# Altium schematic sheet PA_Transmitter_3LD.SchDoc
size A3; PageSetup: Record=PageOptions|CenterHorizontal=True|CenterVertical=True|PrintScale=0.73|XCorrection=1.00|YCorrection=1.00|PrintKind=0|BorderSize=5000000|LeftOffset=0|BottomOffset=0|Orientation=2|PaperLength=1000|PaperWidth=1000|Scale=100|PaperSource=7|PrintQuality=-3|MediaType=1|DitherType=10|PrintScaleMode=1|PaperKind=A4|PaperIndex=9
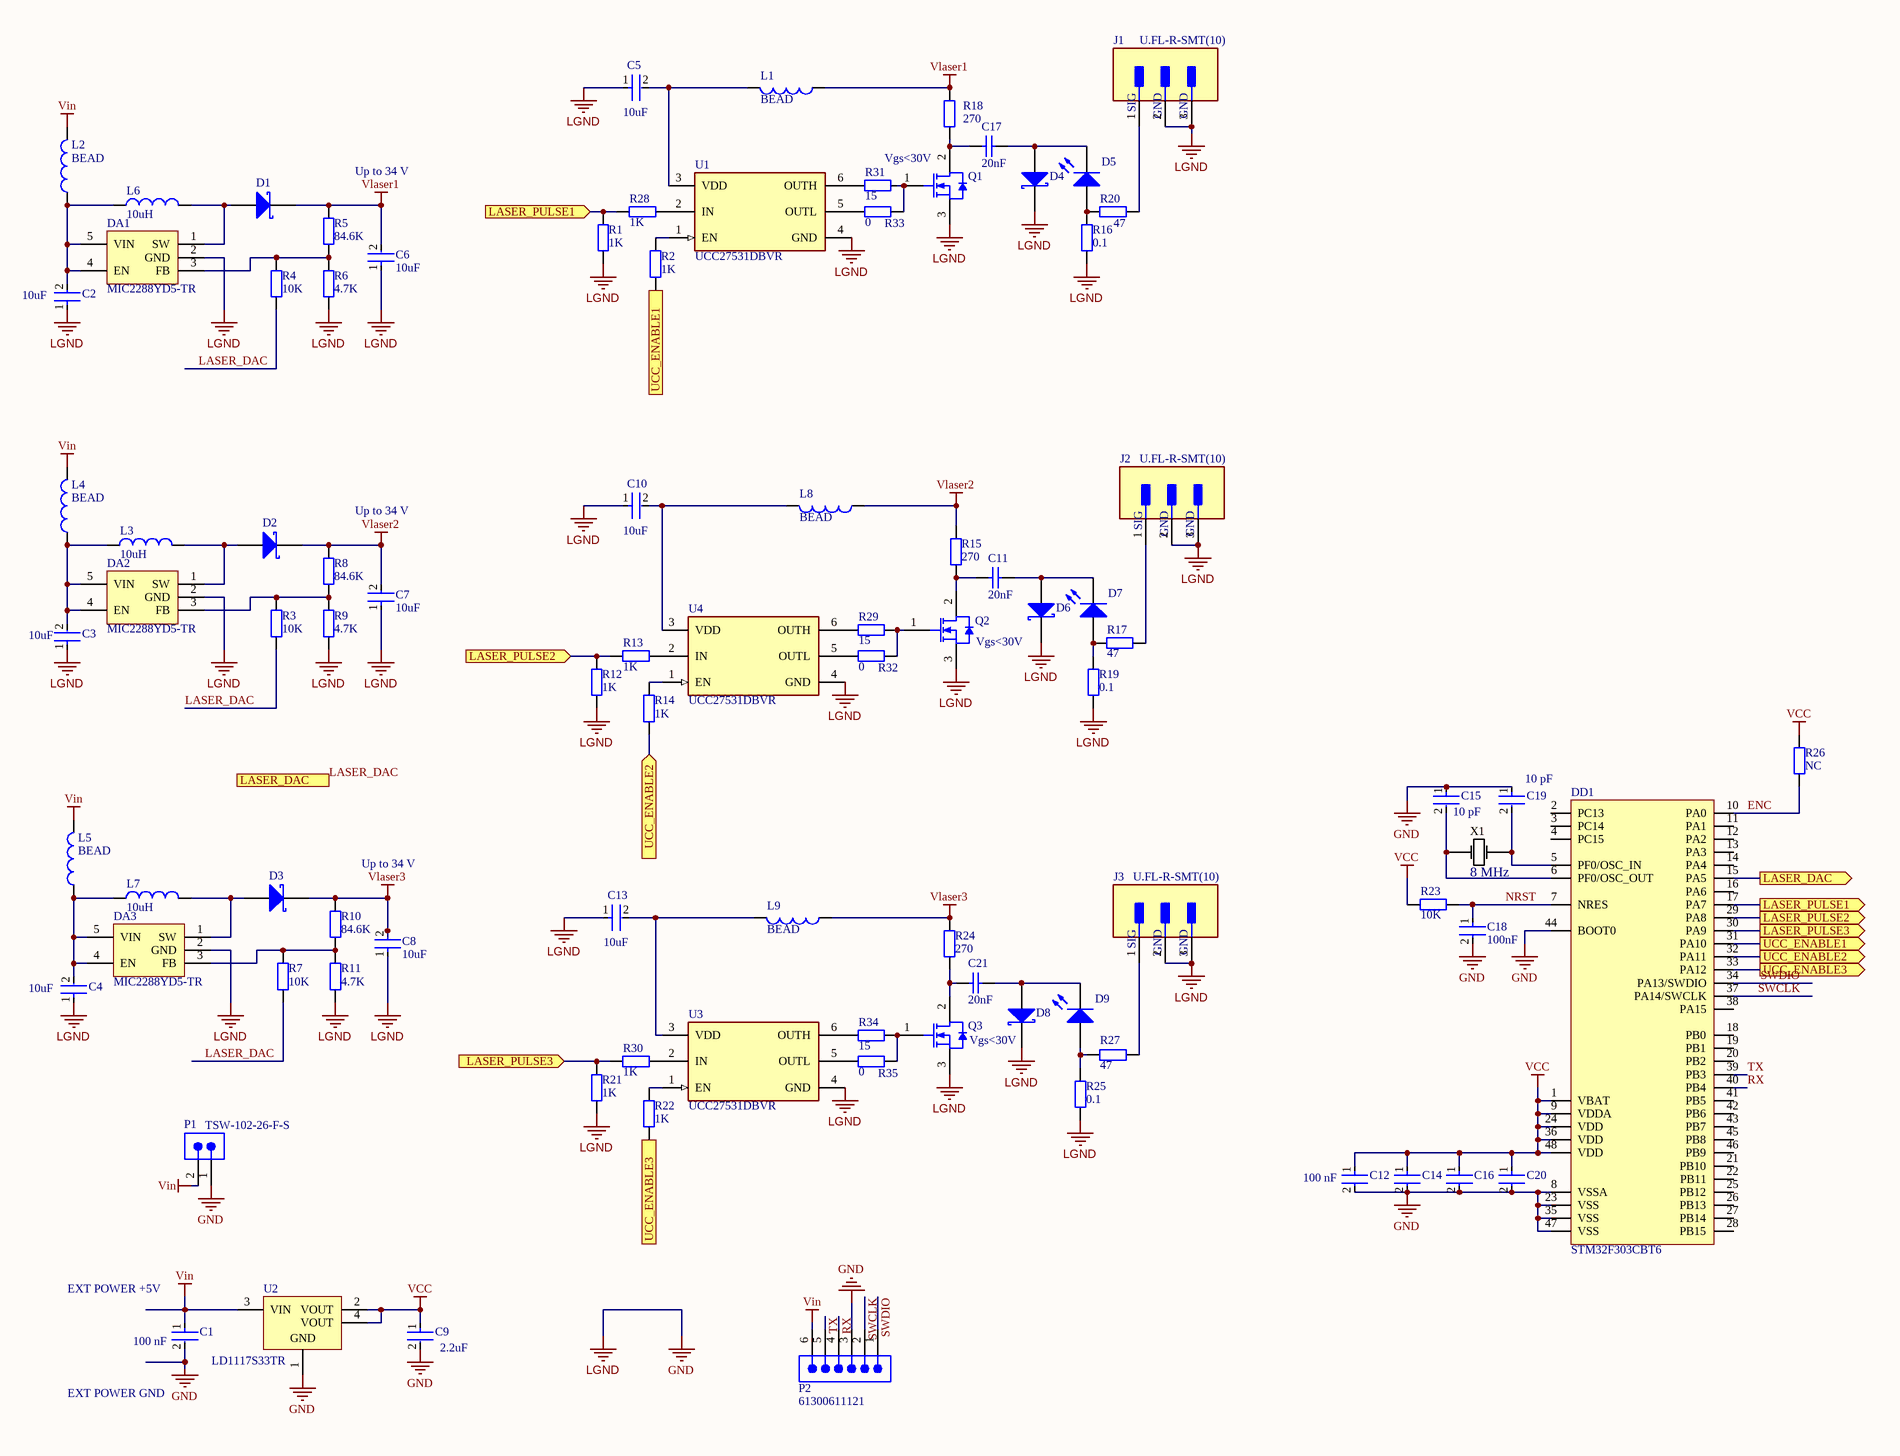
[diagram p0: PA_Transmitter_3LD.SchDoc, right]

## Parts
C1  value 100 nF  [FP-CC0603-DA-MFG]
C2  10uF  [FP-CL31B106KBHNNNE-MFG]
C3  10uF  [FP-CL31B106KBHNNNE-MFG]
C4  10uF  [FP-CL31B106KBHNNNE-MFG]
C5  10uF  [FP-CL31B106KBHNNNE-MFG]
C6  10uF  [FP-CL31B106KBHNNNE-MFG]
C7  10uF  [FP-CL31B106KBHNNNE-MFG]
C8  10uF  [FP-CL31B106KBHNNNE-MFG]
C9  Capacitance: 2.2uF  [FP-CL10-IPC_A]
C10  10uF  [FP-CL31B106KBHNNNE-MFG]
C11  20nF  [RESC2013X60X35NL10T20]
C12  Capacitance: 100 nF  [FP-CC0805-0_85-MFG]  (hidden comment: CC0805KRX7R9BB104)
C13  10uF  [FP-CL31B106KBHNNNE-MFG]
C14  CC0805KRX7R9BB104  [FP-CC0805-0_85-MFG]  (value not drawn)
C15  value 10 pF  [FP-C0805C-DN-MFG]  (hidden comment: C0805C100J5RACTU)
C16  CC0805KRX7R9BB104  [FP-CC0805-0_85-MFG]  (value not drawn)
C17  20nF  [RESC2013X60X35ML10T20]
C18  100nF  [FP-CC0805-0_85-MFG]
C19  value 10 pF  [FP-C0805C-DN-MFG]
C20  CC0805KRX7R9BB104  [FP-CC0805-0_85-MFG]  (value not drawn)
C21  20nF  [RESC2013X60X35NL10T20]
D1  Schottky Diode  [FP-PG-SC79-2-MFG]  (value not drawn)
D2  Schottky Diode  [FP-PG-SC79-2-MFG]  (value not drawn)
D3  Schottky Diode  [FP-PG-SC79-2-MFG]  (value not drawn)
D4  Schottky Diode  [FP-PG-SC79-2-MFG]  (value not drawn)
D5  Light-Emitting Diode  [FP-DPGEW1S09H-MFG]  (value not drawn)
D6  Schottky Diode  [FP-PG-SC79-2-MFG]  (value not drawn)
D7  Light-Emitting Diode  [FP-DPGEW1S09H-MFG]  (value not drawn)
D8  Schottky Diode  [FP-PG-SC79-2-MFG]  (value not drawn)
D9  Light-Emitting Diode  [FP-DPGEW1S09H-MFG]  (value not drawn)
DA1  MIC2288YD5-TR  [FP-TSOT-5LD-PL-1-IPC_A]
DA2  MIC2288YD5-TR  [FP-TSOT-5LD-PL-1-IPC_A]
DA3  MIC2288YD5-TR  [FP-TSOT-5LD-PL-1-IPC_A]
DD1  STM32F303CBT6  [STM-LQFP48_L]
J1  U.FL-R-SMT(10)  [FP-U_FL-R-SMT_10-MFG]
J2  U.FL-R-SMT(10)  [FP-U_FL-R-SMT_10-MFG]
J3  U.FL-R-SMT(10)  [FP-U_FL-R-SMT_10-MFG]
L1  BEAD  [FP-BLM18-0_15-t0_8-IPC_A]
L2  BEAD  [FP-BLM18-0_15-t0_8-IPC_A]
L3  value 10uH  [RESC2013X60X35LL10T20]  (hidden comment: Inductor)
L4  BEAD  [FP-BLM18-0_15-t0_8-IPC_A]
L5  BEAD  [FP-BLM18-0_15-t0_8-IPC_A]
L6  value 10uH  [RESC2013X60X35LL10T20]  (hidden comment: Inductor)
L7  value 10uH  [RESC2013X60X35LL10T20]  (hidden comment: Inductor)
L8  BEAD  [FP-BLM18-0_15-t0_8-IPC_A]
L9  BEAD  [FP-BLM18-0_15-t0_8-IPC_A]
P1  TSW-102-26-F-S  [SMTC-TSW-102-26-XX-S]
P2  61300611121  [61300611121]
Q1  (no value)  [INF-PG-TO252-3-313_N]
Q2  (no value)  [INF-PG-TO252-3-313_N]
Q3  (no value)  [INF-PG-TO252-3-313_N]
R1  1K  [RESC2013X60X35ML10T20]
R2  1K  [RESC2013X60X35ML10T20]
R3  10K  [RESC2013X60X35ML10T20]
R4  10K  [RESC2013X60X35ML10T20]
R5  84.6K  [RESC2013X60X35ML10T20]
R6  4.7K  [RESC2013X60X35ML10T20]
R7  10K  [RESC2013X60X35ML10T20]
R8  84.6K  [RESC2013X60X35ML10T20]
R9  4.7K  [RESC2013X60X35ML10T20]
R10  84.6K  [RESC2013X60X35ML10T20]
R11  4.7K  [RESC2013X60X35ML10T20]
R12  1K  [RESC2013X60X35ML10T20]
R13  1K  [RESC2013X60X35ML10T20]
R14  1K  [RESC2013X60X35ML10T20]
R15  270  [FP-CL31B106KBHNNNE-IPC_A]
R16  0.1  [FP-LLL215-0_1-IPC_B]
R17  47  [RESC2013X60X35ML10T20]
R18  270  [FP-CL31B106KBHNNNE-IPC_A]
R19  0.1  [FP-LLL215-0_1-IPC_B]
R20  47  [RESC2013X60X35ML10T20]
R21  1K  [RESC2013X60X35ML10T20]
R22  1K  [RESC2013X60X35ML10T20]
R23  10K  [RESC2013X60X35ML10T20]
R24  270  [FP-CL31B106KBHNNNE-IPC_A]
R25  0.1  [FP-LLL215-0_1-IPC_B]
R26  NC  [RESC2013X60X35ML10T20]
R27  47  [RESC2013X60X35ML10T20]
R28  1K  [RESC2013X60X35ML10T20]
R29  15  [RESC2013X60X35ML10T20]
R30  1K  [RESC2013X60X35ML10T20]
R31  15  [RESC2013X60X35ML10T20]
R32  0  [RESC2013X60X35ML10T20]
R33  0  [RESC2013X60X35ML10T20]
R34  15  [RESC2013X60X35ML10T20]
R35  0  [RESC2013X60X35ML10T20]
U1  UCC27531DBVR  [FP-DBV0006A-IPC_B]
U2  LD1117S33TR  [SOT-223_L]
U3  UCC27531DBVR  [FP-DBV0006A-IPC_B]
U4  UCC27531DBVR  [FP-DBV0006A-IPC_B]
X1  value 8 MHz  [FP-ASFL1-MFG]  (hidden comment: Quartz)

## Ports
LASER_DAC (in), LASER_DAC (out), LASER_PULSE1 (in), LASER_PULSE1 (out), LASER_PULSE2 (in), LASER_PULSE2 (out), LASER_PULSE3 (in), LASER_PULSE3 (out), UCC_ENABLE1 (in), UCC_ENABLE1 (out), UCC_ENABLE2 (in), UCC_ENABLE2 (out), UCC_ENABLE3 (in), UCC_ENABLE3 (out)

## Nets
GND: C1.2 C2.1 C3.1 C4.1 C5.1 C6.1 C7.1 C8.1 C9.2 C10.1 C12.2 C13.1 C14.2 C15.1 C16.2 C18.2 C19.1 C20.2 D4.2(K) D6.2(K) D8.2(K) DA1.2(GND) DA2.2(GND) DA3.2(GND) DD1.8(VSSA) DD1.23(VSS) DD1.35(VSS) DD1.44(BOOT0) DD1.47(VSS) J1.2(GND) J1.3(GND) J2.2(GND) J2.3(GND) J3.2(GND) J3.3(GND) P1.1 P2.3 Q1.3(SOURCE) Q2.3(SOURCE) Q3.3(SOURCE) R1.1 R6.1 R9.1 R11.1 R12.1 R16.1 R19.1 R21.1 R25.1 U1.4(GND) U2.1(GND) U3.4(GND) U4.4(GND)  [also labelled LGND]
VCC: C9.1 C12.1 C14.1 C16.1 C20.1 DD1.1(VBAT) DD1.9(VDDA) DD1.24(VDD) DD1.36(VDD) DD1.48(VDD) R23.1 R26.1 U2.2(VOUT) U2.4(VOUT)
Vin: C1.1 L2.2 L4.2 L5.2 P1.2 P2.6 U2.3(VIN)
Vlaser1: C6.2 D1.2(K) L1.1 R5.2 R18.2
Vlaser2: C7.2 D2.2(K) L8.1 R8.2 R15.2
Vlaser3: C8.2 D3.2(K) L9.1 R10.2 R24.2
ENC: DD1.10(PA0) R26.2
LASER_DAC: DD1.15(PA5) R3.1 R4.1 R7.1 ; port LASER_DAC
LASER_PULSE1: DD1.17(PA7) R1.2 R28.2 ; port LASER_PULSE1
LASER_PULSE2: DD1.29(PA8) R12.2 R13.2 ; port LASER_PULSE2
LASER_PULSE3: DD1.30(PA9) R21.2 R30.2 ; port LASER_PULSE3
NRST: C18.1 DD1.7(NRES) R23.2
RX: DD1.40(PB4) P2.4
SWCLK: DD1.37(PA14/SWCLK) P2.2
SWDIO: DD1.34(PA13/SWDIO) P2.1
TX: DD1.39(PB3) P2.5
UCC_ENABLE1: DD1.31(PA10) R2.1 ; port UCC_ENABLE1
UCC_ENABLE2: DD1.32(PA11) R14.1 ; port UCC_ENABLE2
UCC_ENABLE3: DD1.33(PA12) R22.1 ; port UCC_ENABLE3
NetC2_2: C2.2 DA1.4(EN) DA1.5(VIN) L2.1 L6.1
NetC3_2: C3.2 DA2.4(EN) DA2.5(VIN) L3.1 L4.1
NetC4_2: C4.2 DA3.4(EN) DA3.5(VIN) L5.1 L7.1
NetC5_2: C5.2 L1.2 U1.3(VDD)
NetC10_2: C10.2 L8.2 U4.3(VDD)
NetC11_1: C11.1 D6.1(A) D7.2(K)
NetC11_2: C11.2 Q2.2(DRAIN) R15.1
NetC13_2: C13.2 L9.2 U3.3(VDD)
NetC15_2: C15.2 DD1.6(PF0/OSC_OUT) X1.1
NetC17_1: C17.1 D4.1(A) D5.2(K)
NetC17_2: C17.2 Q1.2(DRAIN) R18.1
NetC19_2: C19.2 DD1.5(PF0/OSC_IN) X1.3
NetC21_1: C21.1 D8.1(A) D9.2(K)
NetC21_2: C21.2 Q3.2(DRAIN) R24.1
NetD1_1: D1.1(A) DA1.1(SW) L6.2
NetD2_1: D2.1(A) DA2.1(SW) L3.2
NetD3_1: D3.1(A) DA3.1(SW) L7.2
NetD5_1: D5.1(A) R16.2 R20.1
NetD7_1: D7.1(A) R17.2 R19.2
NetD9_1: D9.1(A) R25.2 R27.1
NetDA1_3: DA1.3(FB) R4.2 R5.1 R6.2
NetDA2_3: DA2.3(FB) R3.2 R8.1 R9.2
NetDA3_3: DA3.3(FB) R7.2 R10.1 R11.2
NetJ1_1: J1.1(SIG) R20.2
NetJ2_1: J2.1(SIG) R17.1
NetJ3_1: J3.1(SIG) R27.2
NetQ1_1: Q1.1(GATE) R31.1 R33.1
NetQ2_1: Q2.1(GATE) R29.1 R32.1
NetQ3_1: Q3.1(GATE) R34.1 R35.1
NetR2_2: R2.2 U1.1(EN)
NetR13_1: R13.1 U4.2(IN)
NetR14_2: R14.2 U4.1(EN)
NetR22_2: R22.2 U3.1(EN)
NetR28_1: R28.1 U1.2(IN)
NetR29_2: R29.2 U4.6(OUTH)
NetR30_1: R30.1 U3.2(IN)
NetR31_2: R31.2 U1.6(OUTH)
NetR32_2: R32.2 U4.5(OUTL)
NetR33_2: R33.2 U1.5(OUTL)
NetR34_2: R34.2 U3.6(OUTH)
NetR35_2: R35.2 U3.5(OUTL)

Not connected (* = marked no-connect by the designer): DD1 2(PC13) 3(PC14) 4(PC15) 11(PA1) 12(PA2) 13(PA3) 14(PA4) 16(PA6) 18(PB0) 19(PB1) 20(PB2) 21(PB10) 22(PB11) 25(PB12) 26(PB13) 27(PB14) 28(PB15) 38(PA15) 41(PB5) 42(PB6) 43(PB7) 45(PB8) 46(PB9)

## Notes on the sheet
- Up to 34 V
- (near Q1) Vgs<30V
- Vgs<30V
- EXT POWER +5V
- EXT POWER GND

## Library data of the parts
C1 = CMP-2000-05002-2: CAP CER 0.1UF 16V X7R 0603; Manufacturer Part Number: CC0603KRX7R7BB104; Manufacturer: YAGEO; Tolerance: 0.1; Temperature Coefficient: 15%; Material: Ceramic; Voltage Rating: 16 V; Package: CC0603-DA; ComponentLink2Description: Datasheet; Octopart: https://octopart.com/cc0603krx7r7bb104-yageo-192941; Temperature Range High: +125°C; Digikey Description: CAP CER 0.1UF 16V X7R 0603; Voltage: 16 V; Device Class L2: Capacitors; Height: 0.9mm; Temperature: -55°C to +125°C; Device Class L1: Passive Components; Device Class L3: Ceramic Capacitors; ComponentLink2URL: http://www.yageo.com/documents/recent/UPY-GPHC_X7R_6.3V-to-50V_18.pdf; Footprint Url: http://www.yageo.com/exep/pages/download/literatures/UPY-C_GEN_24.pdf; RoHS: TRUE; Temperature Range Low: -55°C; Temperature Characteristic: X7R; Lead Free: Yes; Capacitance: 100 nF; Category: Cap; Mouser Description: Multilayer Ceramic Capacitor, CC Series, 0.1 - F, - 10%, X7R, 16 V, 0603 [1608 Metric]; Automotive: No
C2-C8 C10 C13 = CMP-2000-07530-2: CAP CER 10UF 50V X7R 1206; Manufacturer: Samsung; Manufacturer Part Number: CL31B106KBHNNNE; Tolerance: 10%; Material: Ceramic; Temperature Coefficient: 15%; Temperature Characteristic: X7R; Digikey Description: CAP CER 10UF 50V X7R 1206; Device Class L1: Passive Components; Value: 10uF; Lead Free: Yes; Device Class L3: Ceramic Capacitors; Octopart: https://octopart.com/cl31b106kbhnnne-samsung-30507377; ComponentLink2URL: http://www.samsungsem.com/global/front/downloadcms.do?path=%2F%2Fglobal%2F%2Fsupport%2F%2Fproduct-search%2F%2Fmlcc%2F%2F__icsFiles%2F%2Fafieldfile%2F%2F2019%2F%2F06%2F%2F18&fileName=CL31B106KBHNNNE-19.pdf; Voltage Rating: 50V; Temperature Range Low: -55°C; RoHS: TRUE; Temperature: -55°C to +125°C; Category: Cap; ComponentLink2Description: Datasheet; Automotive: No; Device Class L2: Capacitors; Capacitance: 10uF; Height: 1.8mm; Temperature Range High: +125°C; Package: CL31B106KBHNNNE
C9 = CMP-13271-003582-1: Cap Ceramic 2.2uF 10V X7R ±10% Pad SMD 0603 +125°C T/R; Max Operating Temperature: 125°C; Package Quantity: 1; Thickness: 0.035inch; Height: 0.8mm; Case/Package: 0603; Case Code (Metric): 1608; Radiation Hardening: No; Dielectric: X7R; Mount: Surface Mount; Contact Plating: Tin; Material: Ceramic; Length: 1.6mm; Packaging: Tape and Reel; Width: 0.031inch; Min Operating Temperature: -55°C; Case Code (Imperial): 0603; Depth: 0.8mm; Voltage Rating: 10V; Tolerance: 10%
C11 C17 C21 = CC0805: Chip capacitor; Voltage: 50V; Series: X7R; Value: 20nF
C12 = CMP-2100-03606-3: CAP CER 0.1UF 50V X7R 0805; Manufacturer: Yageo; Tolerance: 0.1; Value: 100 nF; Material: Ceramic; Device Class L1: Passive Components; ComponentLink2Description: Datasheet; Package: CC0805-0.85; Manufacturer Part Number: CC0805KRX7R9BB104; Digikey Description: CAP CER 0.1UF 50V X7R 0805; Device Class L3: Ceramic Capacitors; Temperature: -30°C to +85°C; Temperature Characteristic: X7R; Voltage Rating: 50 V; Height: 0.95mm; RoHS: TRUE; Ipc Land Pattern Name: CAPC200125X85; Device Class L2: Capacitors; Category: Cap; Temperature Range Low: -30°C; Temperature Range High: +85°C; Mouser Description: Multilayer Ceramic Capacitors MLCC - SMD/SMT 100nF 50V X7R 10%; Footprint Url: http://www.yageo.com/exep/pages/download/literatures/UPY-C_GEN_24.pdf; Automotive: No; Octopart: https://octopart.com/cc0805krx7r9bb104-yageo-192993; Lead Free: Yes; ComponentLink2URL: http://www.yageo.com/documents/recent/UPY-GPHC_Y5V_6.3V-to-50V_8.pdf
C14 C16 C20 = CMP-2100-03606-3: CAP CER 0.1UF 50V X7R 0805; Manufacturer: Yageo; Tolerance: 0.1; Capacitance: 100 nF; Value: 100 nF; Material: Ceramic; Device Class L1: Passive Components; ComponentLink2Description: Datasheet; Package: CC0805-0.85; Manufacturer Part Number: CC0805KRX7R9BB104; Digikey Description: CAP CER 0.1UF 50V X7R 0805; Device Class L3: Ceramic Capacitors; Temperature: -30°C to +85°C; Temperature Characteristic: X7R; Voltage Rating: 50 V; Height: 0.95mm; RoHS: TRUE; Ipc Land Pattern Name: CAPC200125X85; Device Class L2: Capacitors; Category: Cap; Temperature Range Low: -30°C; Temperature Range High: +85°C; Mouser Description: Multilayer Ceramic Capacitors MLCC - SMD/SMT 100nF 50V X7R 10%; Footprint Url: http://www.yageo.com/exep/pages/download/literatures/UPY-C_GEN_24.pdf; Automotive: No; Octopart: https://octopart.com/cc0805krx7r9bb104-yageo-192993; Lead Free: Yes; ComponentLink2URL: http://www.yageo.com/documents/recent/UPY-GPHC_Y5V_6.3V-to-50V_8.pdf
C15 = CMP-03020-021676-1: C0805 10 pF X7R 30ppm/°C 5.00% 50 V; Manufacturer: KEMET; Material: Ceramic; Voltage Rating: 50 V; Tolerance: 0.05; ComponentLink2URL: https://content.kemet.com/datasheets/KEM_C1003_C0G_SMD.pdf; Device Class L2: Capacitors; Octopart: https://octopart.com/c0805c100j5ractu-kemet-81794931; Height: 0.88mm; Ipc Land Pattern Name: CAPC200125X78; ComponentLink2Description: Datasheet; Temperature Range Low: -55°C; Automotive: No; Category: Cap; Device Class L3: Ceramic Capacitors; Device Class L1: Passive Components; Capacitance: 10 pF; Manufacturer Part Number: C0805C100J5RACTU; Temperature Coefficient: 30ppm/°C; Temperature Range High: +125°C; Lead Free: Yes; Package: C0805C-DN; Temperature: -55°C to +125°C; Mouser Description: Cap, 10PF, 50V, Mlcc, 0805; RoHS: TRUE; Temperature Characteristic: X7R
C18 = CMP-2100-03606-3: CAP CER 0.1UF 50V X7R 0805; Manufacturer Part Number: CC0805KRX7R9BB104; Manufacturer: Yageo; Tolerance: 0.1; Material: Ceramic; Device Class L1: Passive Components; ComponentLink2Description: Datasheet; Package: CC0805-0.85; Digikey Description: CAP CER 0.1UF 50V X7R 0805; Capacitance: 100 nF; Device Class L3: Ceramic Capacitors; Value: 100 nF; Temperature: -30°C to +85°C; Temperature Characteristic: X7R; Voltage Rating: 50 V; Height: 0.95mm; RoHS: TRUE; Ipc Land Pattern Name: CAPC200125X85; Device Class L2: Capacitors; Category: Cap; Temperature Range Low: -30°C; Temperature Range High: +85°C; Mouser Description: Multilayer Ceramic Capacitors MLCC - SMD/SMT 100nF 50V X7R 10%; Footprint Url: http://www.yageo.com/exep/pages/download/literatures/UPY-C_GEN_24.pdf; Automotive: No; Octopart: https://octopart.com/cc0805krx7r9bb104-yageo-192993; Lead Free: Yes; ComponentLink2URL: http://www.yageo.com/documents/recent/UPY-GPHC_Y5V_6.3V-to-50V_8.pdf
C19 = CMP-03020-021676-1: C0805 10 pF X7R 30ppm/°C 5.00% 50 V; Manufacturer Part Number: C0805C100J5RACTU; Manufacturer: KEMET; Material: Ceramic; Voltage Rating: 50 V; Tolerance: 0.05; ComponentLink2URL: https://content.kemet.com/datasheets/KEM_C1003_C0G_SMD.pdf; Device Class L2: Capacitors; Octopart: https://octopart.com/c0805c100j5ractu-kemet-81794931; Height: 0.88mm; Ipc Land Pattern Name: CAPC200125X78; ComponentLink2Description: Datasheet; Temperature Range Low: -55°C; Automotive: No; Category: Cap; Device Class L3: Ceramic Capacitors; Device Class L1: Passive Components; Capacitance: 10 pF; Temperature Coefficient: 30ppm/°C; Temperature Range High: +125°C; Lead Free: Yes; Package: C0805C-DN; Temperature: -55°C to +125°C; Mouser Description: Cap, 10PF, 50V, Mlcc, 0805; RoHS: TRUE; Temperature Characteristic: X7R
D1-D4 D6 D8 = Schottky Diode: AF: 1; BV: 0; BV_MAX: 1e99; EG: 1.11; FC: 0.5; IBV: 0.001; IS: 1e-14; MJSW: 0.33; NTUN: 30; TNOM: 27; XTI: 3; SimulationGenericComponent: True; CJO: 0; CJP: 0; CTA: 0; CTP: 0; FCS: 0.5; FV_MAX: 1e99; IKF: 0; IKR: 0; ISR: 1e-14; JSW: 0; JTUN: 0; JTUNSW: 0; KEG: 1; KF: 0; LEVEL: 1; N: 1; NBV: 1; NR: 1; NS: 1; PHP: 1; RS: 0; TCV: 0; TLEV: 0; TLEVC: 0; TM1: 0; TM2: 0; TPB: 0; TPHP: 0; TRS: 0; TRS2: 0; TT: 0; TTT1: 0; TTT2: 0; VJ: 1; XTITUN: 3
D5 D7 D9 = LED: AF: 1; BV: 0; BV_MAX: 1e99; EG: 1.11; FC: 0.5; IBV: 0.001; IS: 1e-14; MJSW: 0.33; NTUN: 30; TNOM: 27; XTI: 3; SimulationGenericComponent: True; CJO: 0; CJP: 0; CTA: 0; CTP: 0; FCS: 0.5; FV_MAX: 1e99; IKF: 0; IKR: 0; ISR: 1e-14; JSW: 0; JTUN: 0; JTUNSW: 0; KEG: 1; KF: 0; LEVEL: 1; N: 1; NBV: 1; NR: 1; NS: 1; PHP: 1; RS: 0; TCV: 0; TLEV: 0; TLEVC: 0; TM1: 0; TM2: 0; TPB: 0; TPHP: 0; TRS: 0; TRS2: 0; TT: 0; TTT1: 0; TTT2: 0; VJ: 1; XTITUN: 3
DA1-DA3 = MIC2288: Step Up; Max Volt: 10V; FB_voltage: 1.24V
DD1 = STM32F3_LQFP48: Microcontroller
J1-J3 = CMP-0029-00003-2: CONN U.FL RCPT STR 50 OHM SMD; Plating: Silver; Connector Type: Coaxial; Frequency: 6GHz; Impedance: 50R; Body Material: Bronze; Dielectric Material: Polymer; Contact Plating: Gold; Termination: Solder; Orientation: Vertical; Contact Material: Brass; Min Operating Temperature: -40°C; Mount: Surface Mount; Lead Free: Lead Free; Max Operating Temperature: 90°C; Radiation Hardening: No; Packaging: Tape and Reel; Body Plating: Silver; Fastening Type: Snap; Max Frequency: 6GHz; Depth: 3.1mm; Package Quantity: 1; Case/Package: SMD/SMT; Housing Color: Beige; Length: 3mm
L1 L2 L4 L5 L8 L9 = BEAD: Ferrit Bead; Created data: 2010-10-16; Value: BEAD
L3 L6 L7 = Inductor: SimulationGenericComponent: True
P1 = CMP-1024-00329-1: 0.025" SQ Post Header, Through-hole, Vertical, -55 to 125 degC, 2.54 mm Pitch, 2-Pin, Male, RoHS; Manufacturer: Samtec; Pitch: 2.54 mm; PackageVersion: DM, 8/1988; ComponentLink2Description: Datasheet; PackageReference: TSW-102-26-XX-S; ComponentLink3URL: http://www.samtec.com/documents/webfiles/cpdf/TSW-XXX-XX-XXX-X-XX-XXX-MKT.pdf; ComponentLink2URL: http://www.samtec.com/documents/webfiles/pdf/TSW_TH.PDF; ComponentLink1Description: Manufacturer URL; DatasheetVersion: F-214; RoHS: True; ComponentLink3Description: Package Specification; PartNumber: TSW-102-26-F-S; Temperature Range: -55 to 125 degC; Orientation: Vertical; ComponentLink1URL: http://www.samtec.com; PackageDescription: .025[0.64] SQ. Post Terminal Strip Assembly; Mounting Technology: Through-hole
P2 = CMP-1502-01070-3: NexarPartId: 20084590; Current Rating: 3A; Pitch: 2.54mm; Gender: Male; Operating Supply Voltage: 250V; Connector Type: Male Pin; Number of Positions: 6; Contact Resistance: 20mΩ; Packaging: Bulk; Number of Pins: 6; Number of Rows: 1; Contact Plating: Gold; Lead Free: Lead Free; RoHS: Compliant; Contact Mating Length: 5.9944mm; Voltage Rating: 250V; REACH SVHC: Unknown; Contact Gender: Male; Housing Material: PBT; Min Operating Temperature: -40°C; Lead Pitch: 2.54mm; Mount: Through Hole; Number of Contacts: 6; Max Operating Temperature: 105°C; Contact Material: Copper; Orientation: Vertical; Termination: Through Hole; Color: Black; Height: 8.89mm
Q1-Q3 = CMP-1164-00353-1: N-Channel CoolMOS C6 Power-Transistor, 600 V VDS, 8.1 A ID, -55 to 150 degC, PG-TO252-3-313, Reel, Green; Manufacturer: Infineon; PartNumber: IPD60R520C6; QG: 23.4Â nC; VGS(th) (max): 3.5Â V; Green: TRUE; Ptot (max): 66Â W; Polarity: N; RthJC (max): 1.9Â K/W; ID (max): 8.1Â A; VDS (max): 600Â V; RDS (on) (max): 520Â mOhm; RthJA (max): 62Â K/W; IDpuls (max): 22Â A; VGS(th) (min): 2.5Â V; PackageVersion: Oct-10; Packing: Reel; PackageReference: PG-TO252-3-313; Mounting Technology: Surface Mount; ComponentLink1URL: http://www.infineon.com/; ComponentLink3Description: Package Specification; ComponentLink2Description: Datasheet; Rth: 1.9Â K/W; ComponentLink3URL: http://www.infineon.com/dgdl/PG-TO252-3-313-Package_Overview.pdf?folderId=db3a30432b57a660012b81890ade72d2&fileId=db3a30432b57a660012b8193af2872eb; PackageDescription: 3-Pin Plastic (Green) Transistor Single Outline Package, 6.5 x 6.12 mm Body, 2.28 mm Pitch; Technology: CoolMOS C6; ComponentLink1Description: Manufacturer URL; DatasheetVersion: Rev. 2.0; ComponentLink2URL: http://www.infineon.com/dgdl/IPD60R520C6_2.0.pdf?folderId=db3a3043163797a6011638933eda014b&fileId=db3a304323b87bc20123e676d18358fb
R1-R35 = RC0805: Chip resistor; Tolerance: 5%
  R1 R2 R12-R14 R21 R22 R28 R30: Value: 1K
  R3 R4 R7 R23: Value: 10K
  R5 R8 R10: Value: 84.6K
  R6 R9 R11: Value: 4.7K
  R15 R18 R24: Value: 270
  R16 R19 R25: Value: 0.1
  R17 R20 R27: Value: 47
  R26: Value: NC
  R29 R31 R34: Value: 15
  R32 R33 R35: Value: 0
U1 U3 U4 = CMP-04912-000077-1: IC GATE DRVR LOW-SIDE SOT23-6; Fall Time: 7ns; Output Current: 5A; Number of Channels: 1; Turn-Off Delay Time: 17ns; Number of Outputs: 2; Max Supply Voltage: 35V; Turn-On Delay Time: 26ns; Rise Time: 15ns; Min Supply Voltage: 10V; Operating Supply Voltage: 32V; Mount: Surface Mount; Min Operating Temperature: -40°C; Series: -; Number of Drivers: 1; Lead Free: Lead Free; Max Operating Temperature: 125°C; Packaging: Tape and Reel; Case/Package: SOT-23-6; RoHS Compliant: Yes; Package Quantity: 1; Number of Pins: 6
U2 = CMP-0244-00310-1: Fixed Low Drop Positive Voltage Regulator, 3.3V, 4-Pin SOT-223, Tape and Reel; ComponentLink2Description: Datasheet; PackageDescription: 4-Pin SOT-223 Package, 6.5 x 3.5 mm Body, 2.3 mm Pitch, 7 mm Lead Span; PackageVersion: 2010; ComponentLink2URL: http://www.st.com/internet/com/TECHNICAL_RESOURCES/TECHNICAL_LITERATURE/DATASHEET/CD00000544.pdf; PackageReference: SOT-223; DatasheetVersion: 1/11/2011; ComponentLink1Description: Manufacturer URL; ComponentLink1URL: http://www.st.com
X1 = Quartz_SX-6: Quartz_SX-6 (SMD06035C4)